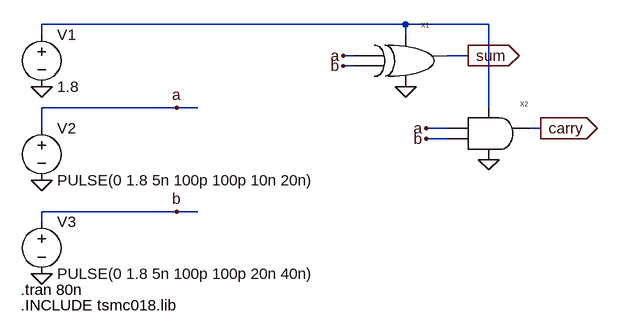
[diagram p0: schematic half_adder.asc]
half_adder.asc, the LTspice schematic file:
Version 4
SHEET 1 880 680
WIRE 480 0 -80 0
WIRE 608 0 480 0
WIRE -80 16 -80 0
WIRE 480 16 480 0
WIRE 400 48 384 48
WIRE 576 48 544 48
WIRE 400 64 384 64
WIRE 128 128 -80 128
WIRE 160 128 128 128
WIRE 608 128 608 0
WIRE -80 160 -80 128
WIRE 544 160 512 160
WIRE 688 160 672 160
WIRE 544 176 512 176
WIRE 128 288 -80 288
WIRE 160 288 128 288
WIRE -80 304 -80 288
FLAG -80 96 0
FLAG -80 240 0
FLAG -80 384 0
FLAG 480 96 0
FLAG 608 208 0
FLAG 128 128 a
FLAG 384 48 a
FLAG 512 160 a
FLAG 128 288 b
FLAG 384 64 b
FLAG 512 176 b
FLAG 576 48 sum
IOPIN 576 48 Out
FLAG 688 160 carry
IOPIN 688 160 Out
SYMBOL voltage -80 0 R0
WINDOW 123 0 0 Left 0
WINDOW 39 0 0 Left 0
SYMATTR InstName V1
SYMATTR Value 1.8
SYMBOL voltage -80 144 R0
WINDOW 123 0 0 Left 0
WINDOW 39 0 0 Left 0
SYMATTR InstName V2
SYMATTR Value PULSE(0 1.8 5n 100p 100p 10n 20n)
SYMBOL voltage -80 288 R0
WINDOW 123 0 0 Left 0
WINDOW 39 0 0 Left 0
SYMATTR InstName V3
SYMATTR Value PULSE(0 1.8 5n 100p 100p 20n 40n)
SYMBOL xor 528 64 R0
SYMATTR InstName X1
SYMBOL and 656 176 R0
SYMATTR InstName X2
TEXT -112 408 Left 2 !.tran 80n
TEXT -112 432 Left 2 !.INCLUDE tsmc018.lib

The netlist it stands for:
* half_adder.asc
V1 N001 0 1.8
V2 a 0 PULSE(0 1.8 5n 100p 100p 10n 20n)
V3 b 0 PULSE(0 1.8 5n 100p 100p 20n 40n)
XX1 a b N001 0 sum xor  ; pins A B vdd vss Vout
XX2 a b N001 0 carry and  ; pins a b vdd vss And
.tran 80n
.INCLUDE tsmc018.lib
.backanno
.end